# EAGLE schematic HW4 (EAGLE 9.6.2)
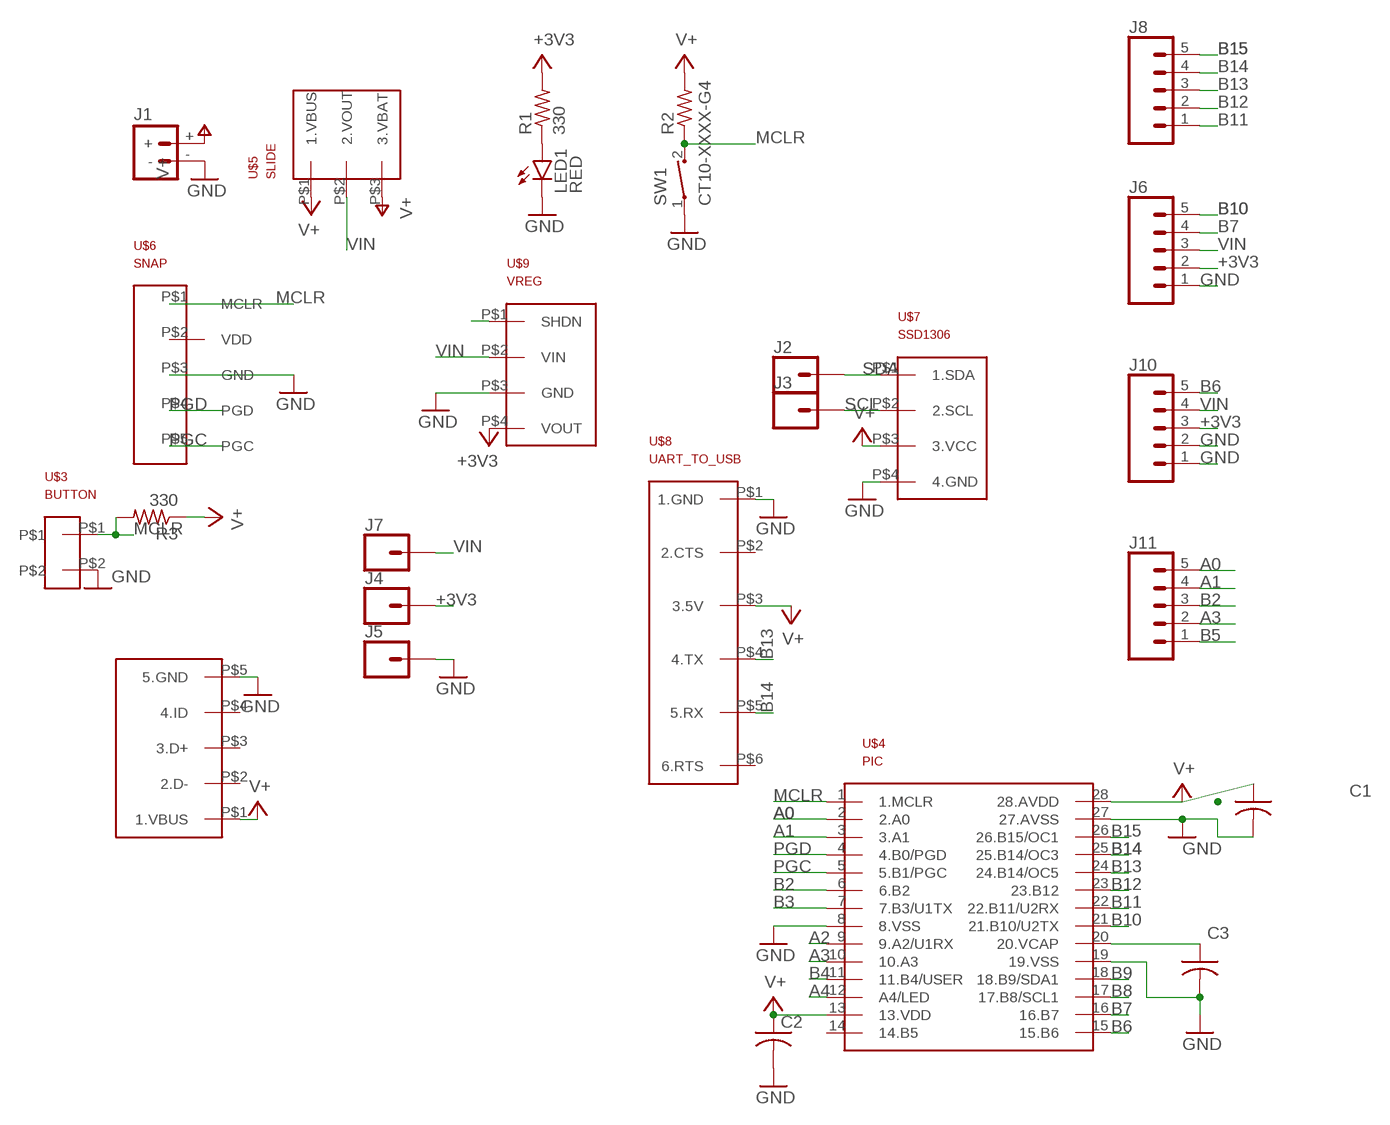
[diagram p0: schematic, sheet 1]

## Parts
C1  C-US025-030X050  [C025-030X050]
C2  C-US025-030X050  [C025-030X050]
C3  C-US025-030X050  [C025-030X050]
J1  BATTERY_CONN_DEANS  [DEANS]
J2  CONN_01  [1X01]
J3  CONN_01  [1X01]
J4  CONN_01PTH_2MM  [1X01_2MM]
J5  CONN_01PTH_2MM  [1X01_2MM]
J6  CONN_05  [1X05]
J7  CONN_01PTH_2MM  [1X01_2MM]
J8  CONN_05  [1X05]
J10  CONN_05  [1X05]
J11  CONN_05  [1X05]
LED1  RED  LED5MM  [LED5MM]
R1  330  R-US_0204/7  [0204/7]
R2  R-US_0309/10  [0309/10]
R3  330  R-US_0204/7  [0204/7]
SW1  CT10-XXXX-G4  [CT10-XXXX-G4]
U$3  BUTTON  [BUTTON]
U$4  PIC  [PIC]
U$5  SLIDE  [SLIDE]
U$6  SNAP  [SNAP]
U$7  SSD1306  [SSD1306]
U$8  UART_TO_USB  [UART_TO_USB]
U$9  VREG  [VREG]
U$10  MICROUSB  [MICROUSB]

## Nets
+3V3: J4.1 J6.2 J10.3
A0: J11.5 U$4.2(2.A0)
A1: J11.4 U$4.3(3.A1)
A2: U$4.9(9.A2/U1RX)
A3: J11.2 U$4.10(10.A3)
A4: U$4.12(A4/LED)
B2: J11.3 U$4.6(6.B2)
B3: U$4.7(7.B3/U1TX)
B4: U$4.11(11.B4/USER)
B5: J11.1
B6: J10.5 U$4.15(15.B6)
B7: J6.4 U$4.16(16.B7)
B8: U$4.17(17.B8/SCL1)
B9: U$4.18(18.B9/SDA1)
B10: J6.5 U$4.21(21.B10/U2TX)
B11: J8.1 U$4.22(22.B11/U2RX)
B12: J8.2 U$4.23(23.B12)
B13: J8.3 U$4.24(24.B14/OC5) U$8.P$4(4.TX)
B14: J8.4 U$4.25(25.B14/OC3) U$8.P$5(5.RX)
B15: J8.5 U$4.26(26.B15/OC1)
GND: C1.2 C2.2 C3.2 J1.- J5.1 J6.1 J10.1 J10.2 LED1.K(C) SW1.1 U$3.P$2 U$4.8(8.VSS) U$4.19(19.VSS) U$4.27(27.AVSS) U$6.P$3(GND) U$7.P$4(4.GND) U$8.P$1(1.GND) U$9.P$3(GND) U$10.P$5(5.GND)
MCLR: R2.1 R3.2 SW1.2 U$3.P$1 U$4.1(1.MCLR) U$6.P$1(MCLR)
N$1: U$9.P$1(SHDN)
N$2: LED1.A R1.1
N$3: C3.1 U$4.20(20.VCAP)
PGC: U$4.5(5.B1/PGC) U$6.P$5(PGC)
PGD: U$4.4(4.B0/PGD) U$6.P$4(PGD)
SCL: J3.1 U$7.P$2(2.SCL)
SDA: J2.1 U$7.P$1(1.SDA)
V+: C1.1 C2.1 J1.+ R1.2 R2.2 R3.1 U$4.13(13.VDD) U$4.28(28.AVDD) U$5.P$1(1.VBUS) U$5.P$3(3.VBAT) U$7.P$3(3.VCC) U$8.P$3(3.5V) U$9.P$4(VOUT) U$10.P$1(1.VBUS) ; supply symbol labelled +3V3
VIN: J6.3 J7.1 J10.4 U$5.P$2(2.VOUT) U$9.P$2(VIN)
Unconnected: U$4.14(14.B5) U$6.P$2(VDD) U$8.P$2(2.CTS) U$8.P$6(6.RTS) U$10.P$2(2.D-) U$10.P$3(3.D+) U$10.P$4(4.ID)

## Library data of the parts
C1-C3 = PIC:C-US: CAPACITOR, American symbol; SPICEPREFIX: C
J1 = SparkFun-Connectors:BATTERY_CONN: Battery Connectors Various footprints for battery connections SparkFun Products: Deans Connector -M/F Pair <https://www.sparkfun.com/products/11864>; SF_ID: PRT-11864
J2-J5 J7 = SparkFun-Connectors:CONN_01: Single connection point. Often used as Generic Header-pin footprint for 0.1 inch spaced/style header connections On any of the 0.1 inch spaced packages, you can populate with these: Break Away Headers - Straight <https://www.sparkfun.com/products/116> (PRT-00116) Break Away Male Headers - Right Angle <https://www.sparkfun.com/products/553> (PRT-00553) Female Headers <https://www.sparkfun.com/products/115> (PRT-00115) Break Away Headers - Machine Pin <https://www.sparkfun.com/products/117> (PRT-00117) Break Away Female Headers - Swiss Machine Pin <https://www.sparkfun.com/products/743> (PRT-00743) This device is also useful as a general connection point to wire up your design to another part of your project. Our various solder wires solder well into these plated through hole pads. Hook-Up Wire - Assortment (Stranded, 22 AWG) <https://www.sparkfun.com/products/11375> (PRT-11375) Hook-Up Wire - Assortment (Solid Core, 22 AWG) <https://www.sparkfun.com/products/11367> (PRT-11367) View the entire wire category on our website here <https://www.sparkfun.com/categories/141> Special notes: SMTSO-256-ET is a "flush mount" nut for a 4-40 screw. We mostly use this on specialty testbeds; it is a nice way to connect hardware to your PCB at an adjustable hieght. Also note, the SNAP packages are for using a snappable style connector. We sell a baggie of snaps and they are also used on two LilyPad designs: Snap Assortment - 30 pack (male and female) <https://www.sparkfun.com/products/11347> (DEV-11347) LilyPad Arduino SimpleSnap <https://www.sparkfun.com/products/10941> (DEV-10941) LilyPad SimpleSnap Protoboard <https://www.sparkfun.com/products/10940> (DEV-10940)
J6 J8 J10 J11 = SparkFun-Connectors:CONN_05: Multi connection point. Often used as Generic Header-pin footprint for 0.1 inch spaced/style header connections On any of the 0.1 inch spaced packages, you can populate with these: Break Away Headers - Straight <https://www.sparkfun.com/products/116> (PRT-00116) Break Away Male Headers - Right Angle <https://www.sparkfun.com/products/553> (PRT-00553) Female Headers <https://www.sparkfun.com/products/115> (PRT-00115) Break Away Headers - Machine Pin <https://www.sparkfun.com/products/117> (PRT-00117) Break Away Female Headers - Swiss Machine Pin <https://www.sparkfun.com/products/743> (PRT-00743) For SCREWTERMINALS and SPRING TERMINALS visit here: Screw Terimnals on SparkFun.com <https://www.sparkfun.com/search/results?term=Screw+Terminals> (5mm/3.5mm/2.54mm spacing) This device is also useful as a general connection point to wire up your design to another part of your project. Our various solder wires solder well into these plated through hole pads. Hook-Up Wire - Assortment (Stranded, 22 AWG) <https://www.sparkfun.com/products/11375> (PRT-11375) Hook-Up Wire - Assortment (Solid Core, 22 AWG) <https://www.sparkfun.com/products/11367> (PRT-11367) View the entire wire category on our website here <https://www.sparkfun.com/categories/141> Special notes: Molex polarized connector foot print use with SKU : PRT-08231 with associated crimp pins and housings. 1MM SMD Version SKU: PRT-10208
LED1 = led:LED: LED OSRAM: - CHIPLED LG R971, LG N971, LY N971, LG Q971, LY Q971, LO R971, LY R971 LH N974, LH R974 LS Q976, LO Q976, LY Q976 LO Q996 - Hyper CHIPLED LW Q18S LB Q993, LB Q99A, LB R99A - SideLED LS A670, LO A670, LY A670, LG A670, LP A670 LB A673, LV A673, LT A673, LW A673 LH A674 LY A675 LS A676, LA A676, LO A676, LY A676, LW A676 LS A679, LY A679, LG A679 - Hyper Micro SIDELED® LS Y876, LA Y876, LO Y876, LY Y876 LT Y87S - SmartLED LW L88C, LW L88S LB L89C, LB L89S, LG L890 LS L89K, LO L89K, LY L89K LS L896, LA L896, LO L896, LY L896 - TOPLED LS T670, LO T670, LY T670, LG T670, LP T670 LSG T670, LSP T670, LSY T670, LOP T670, LYG T670 LG T671, LOG T671, LSG T671 LB T673, LV T673, LT T673, LW T673 LH T674 LS T676, LA T676, LO T676, LY T676, LB T676, LH T676, LSB T676, LW T676 LB T67C, LV T67C, LT T67C, LS T67K, LO T67K, LY T67K, LW E67C LS E67B, LA E67B, LO E67B, LY E67B, LB E67C, LV E67C, LT E67C LW T67C LS T679, LY T679, LG T679 LS T770, LO T770, LY T770, LG T770, LP T770 LB T773, LV T773, LT T773, LW T773 LH T774 LS E675, LA E675, LY E675, LS T675 LS T776, LA T776, LO T776, LY T776, LB T776 LHGB T686 LT T68C, LB T68C - Hyper Mini TOPLED® LB M676 - Mini TOPLED Santana® LG M470 LS M47K, LO M47K, LY M47K Source: http://www.osram.convergy.de LUXEON: - LUMILED® LXK2-PW12-R00, LXK2-PW12-S00, LXK2-PW14-U00, LXK2-PW14-V00 LXK2-PM12-R00, LXK2-PM12-S00, LXK2-PM14-U00 LXK2-PE12-Q00, LXK2-PE12-R00, LXK2-PE12-S00, LXK2-PE14-T00, LXK2-PE14-U00 LXK2-PB12-K00, LXK2-PB12-L00, LXK2-PB12-M00, LXK2-PB14-N00, LXK2-PB14-P00, LXK2-PB14-Q00 LXK2-PR12-L00, LXK2-PR12-M00, LXK2-PR14-Q00, LXK2-PR14-R00 LXK2-PD12-Q00, LXK2-PD12-R00, LXK2-PD12-S00 LXK2-PH12-R00, LXK2-PH12-S00 LXK2-PL12-P00, LXK2-PL12-Q00, LXK2-PL12-R00 Source: www.luxeon.com KINGBRIGHT: KA-3528ASYC Source: www.kingbright.com
R1 R3 = rcl:R-US_: RESISTOR, American symbol; SPICEPREFIX: R
R2 = PIC:R-US_: RESISTOR, American symbol; SPICEPREFIX: R
SW1 = switch-coto:CT10-XXXX-: CT10 Series Molded Switch Source: www.cotorelay.com .. Coto_Technology__CT10-1530-G1.pdf
U$3 = PIC:BUTTON
U$4 = PIC:PIC
U$5 = PIC:SLIDE
U$6 = PIC:SNAP
U$7 = PIC:SSD1306
U$8 = PIC:UART_TO_USB
U$9 = PIC:VREG
U$10 = PIC:MICROUSB